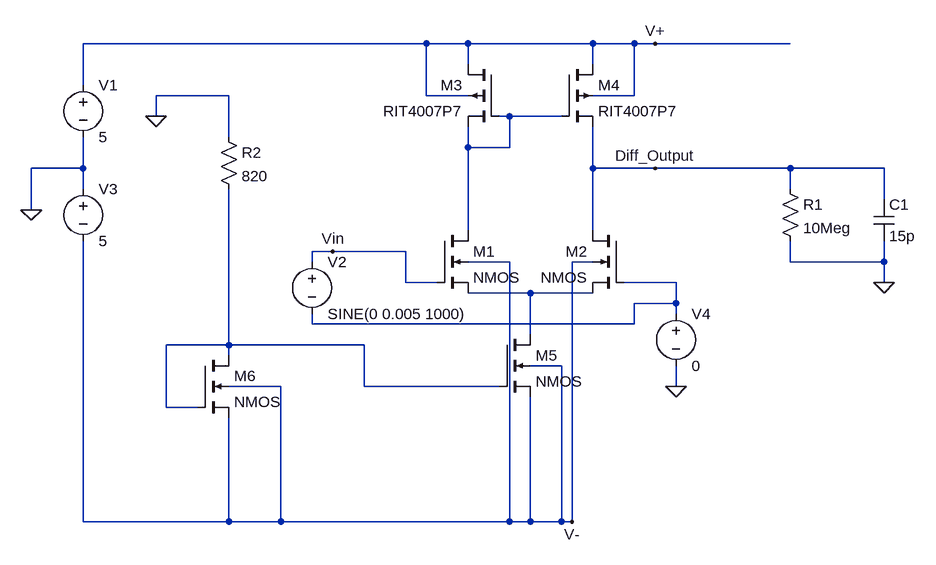
[diagram p0: schematic Draft1.asc]
Draft1.asc, the LTspice schematic file:
Version 4
SHEET 1 1336 796
WIRE 576 16 48 16
WIRE 640 16 576 16
WIRE 832 16 640 16
WIRE 896 16 832 16
WIRE 928 16 896 16
WIRE 1136 16 928 16
WIRE 640 48 640 16
WIRE 832 48 832 16
WIRE 48 80 48 16
WIRE 272 96 160 96
WIRE 576 96 576 16
WIRE 640 96 576 96
WIRE 896 96 896 16
WIRE 896 96 832 96
WIRE 160 128 160 96
WIRE 704 128 688 128
WIRE 784 128 704 128
WIRE 272 160 272 96
WIRE 640 176 640 144
WIRE 704 176 704 128
WIRE 704 176 640 176
WIRE 48 208 48 160
WIRE 48 208 -32 208
WIRE 832 208 832 144
WIRE 928 208 832 208
WIRE 1136 208 928 208
WIRE 1280 208 1136 208
WIRE 48 240 48 208
WIRE 1136 240 1136 208
WIRE 1280 256 1280 208
WIRE -32 272 -32 208
WIRE 640 304 640 176
WIRE 832 304 832 208
WIRE 432 336 400 336
WIRE 544 336 432 336
WIRE 400 352 400 336
WIRE 704 352 640 352
WIRE 832 352 800 352
WIRE 1136 352 1136 320
WIRE 1280 352 1280 320
WIRE 1280 352 1136 352
WIRE 544 384 544 336
WIRE 592 384 544 384
WIRE 960 384 880 384
WIRE 1280 384 1280 352
WIRE 736 400 640 400
WIRE 832 400 736 400
WIRE 960 416 960 384
WIRE 960 416 896 416
WIRE 960 432 960 416
WIRE 400 448 400 432
WIRE 896 448 896 416
WIRE 896 448 400 448
WIRE 736 464 736 400
WIRE 272 480 272 240
WIRE 272 480 176 480
WIRE 480 480 272 480
WIRE 272 496 272 480
WIRE 784 512 736 512
WIRE 352 544 272 544
WIRE 480 544 480 480
WIRE 688 544 480 544
WIRE 960 544 960 512
WIRE 176 576 176 480
WIRE 224 576 176 576
WIRE 48 752 48 320
WIRE 272 752 272 592
WIRE 272 752 48 752
WIRE 352 752 352 544
WIRE 352 752 272 752
WIRE 704 752 704 352
WIRE 704 752 352 752
WIRE 736 752 736 560
WIRE 736 752 704 752
WIRE 784 752 784 512
WIRE 784 752 736 752
WIRE 800 752 800 352
WIRE 800 752 784 752
FLAG 160 128 0
FLAG 1280 384 0
FLAG 960 544 0
FLAG 432 336 Vin
FLAG 928 208 Diff_Output
FLAG 800 752 V-
FLAG 928 16 V+
FLAG -32 272 0
SYMBOL voltage 48 64 R0
SYMATTR InstName V1
SYMATTR Value 5
SYMBOL voltage 48 224 R0
SYMATTR InstName V3
SYMATTR Value 5
SYMBOL res 256 144 R0
SYMATTR InstName R2
SYMATTR Value 820
SYMBOL pmos4 688 48 M0
SYMATTR InstName M3
SYMATTR Value RIT4007P7
SYMBOL pmos4 784 48 R0
SYMATTR InstName M4
SYMATTR Value RIT4007P7
SYMBOL res 1120 224 R0
SYMATTR InstName R1
SYMATTR Value 10Meg
SYMBOL cap 1264 256 R0
SYMATTR InstName C1
SYMATTR Value 15p
SYMBOL nmos4 592 304 R0
SYMATTR InstName M1
SYMBOL nmos4 880 304 M0
SYMATTR InstName M2
SYMBOL nmos4 688 464 R0
SYMATTR InstName M5
SYMBOL voltage 960 416 R0
SYMATTR InstName V4
SYMATTR Value 0
SYMBOL voltage 400 336 R0
WINDOW 123 0 0 Left 0
WINDOW 39 0 0 Left 0
SYMATTR InstName V2
SYMATTR Value SINE(0 0.005 1000)
SYMBOL nmos4 224 496 R0
SYMATTR InstName M6

The netlist it stands for:
* Draft1.asc
V1 V+ 0 5
V3 0 V- 5
R2 0 N004 820
M3 V+ N001 N001 V+ RIT4007P7
M4 V+ N001 Diff_Output V+ RIT4007P7
R1 Diff_Output 0 10Meg
C1 Diff_Output 0 15p
M1 N001 Vin N003 V- NMOS
M2 Diff_Output N002 N003 V- NMOS
M5 N003 N004 V- V- NMOS
V4 N002 0 0
V2 Vin N002 SINE(0 0.005 1000)
M6 N004 N004 V- V- NMOS
.model NMOS NMOS
.model PMOS PMOS
.lib standard.mos
.backanno
.end